# EAGLE schematic Schematic_rfclock_uwb (EAGLE 9.6.2)
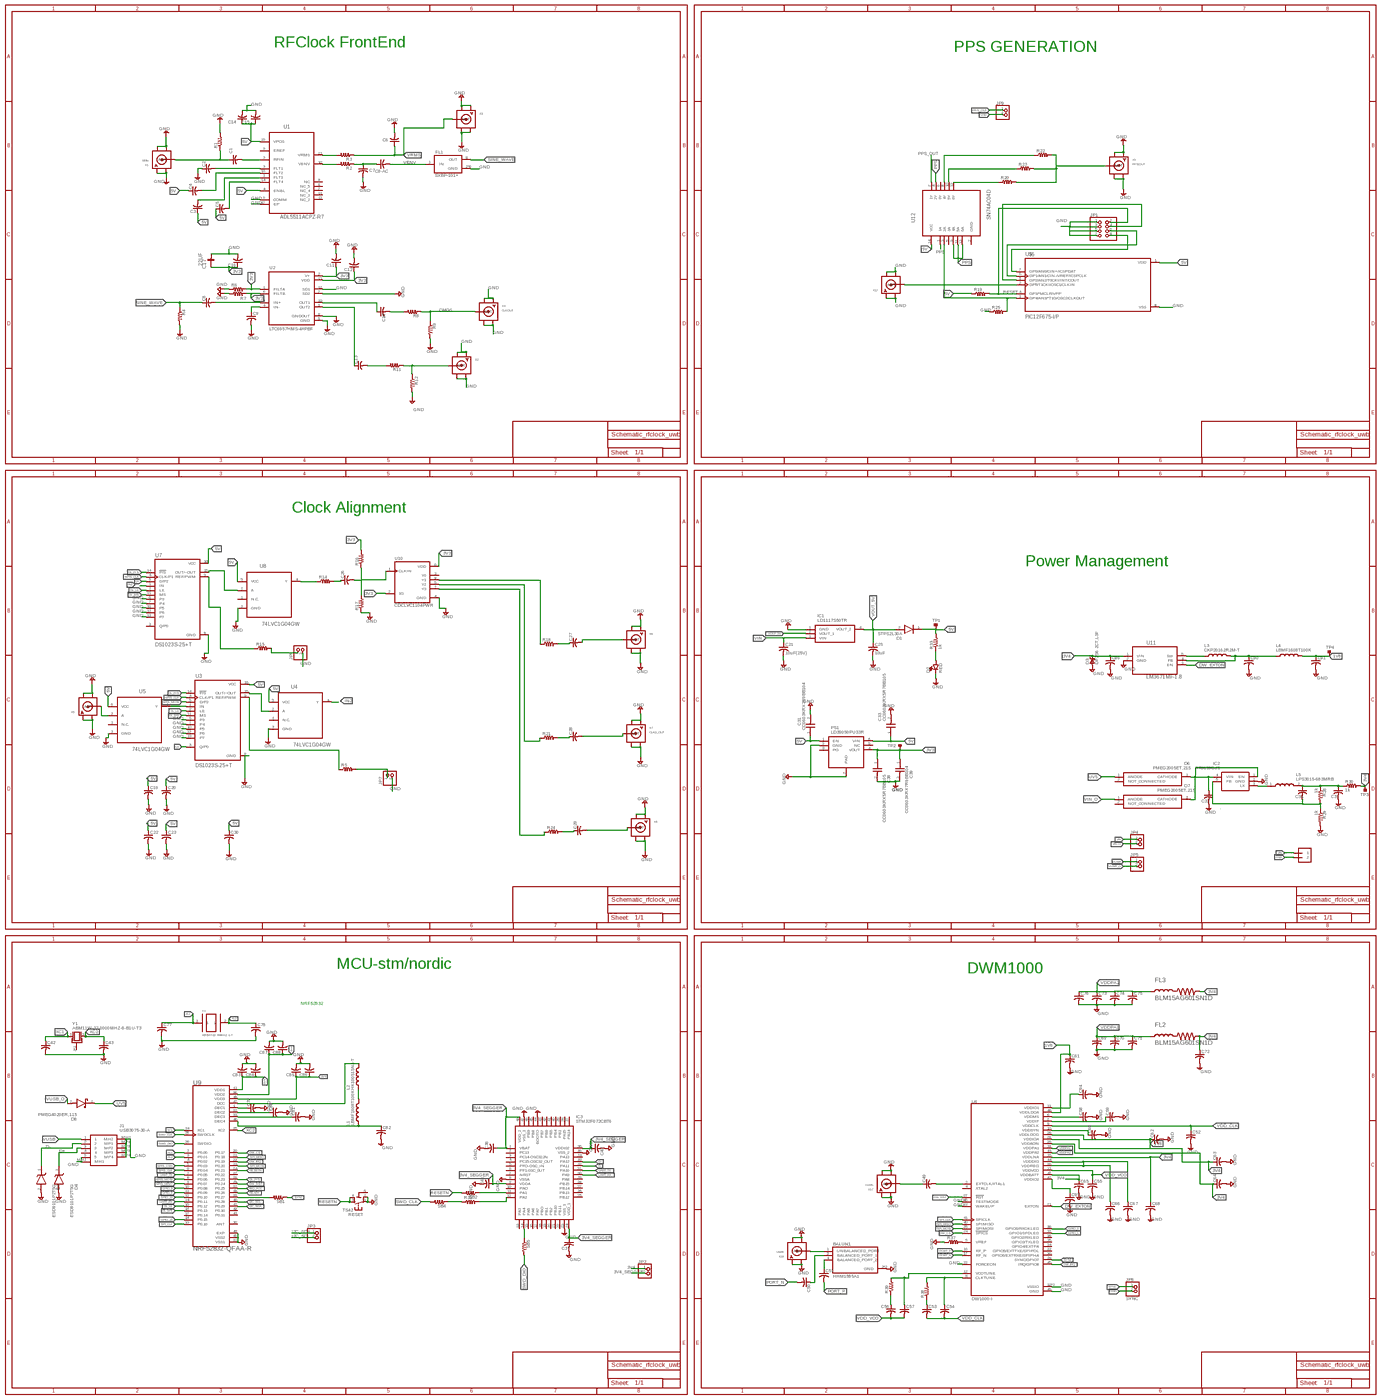
[diagram p0: schematic, sheet 1, overview]
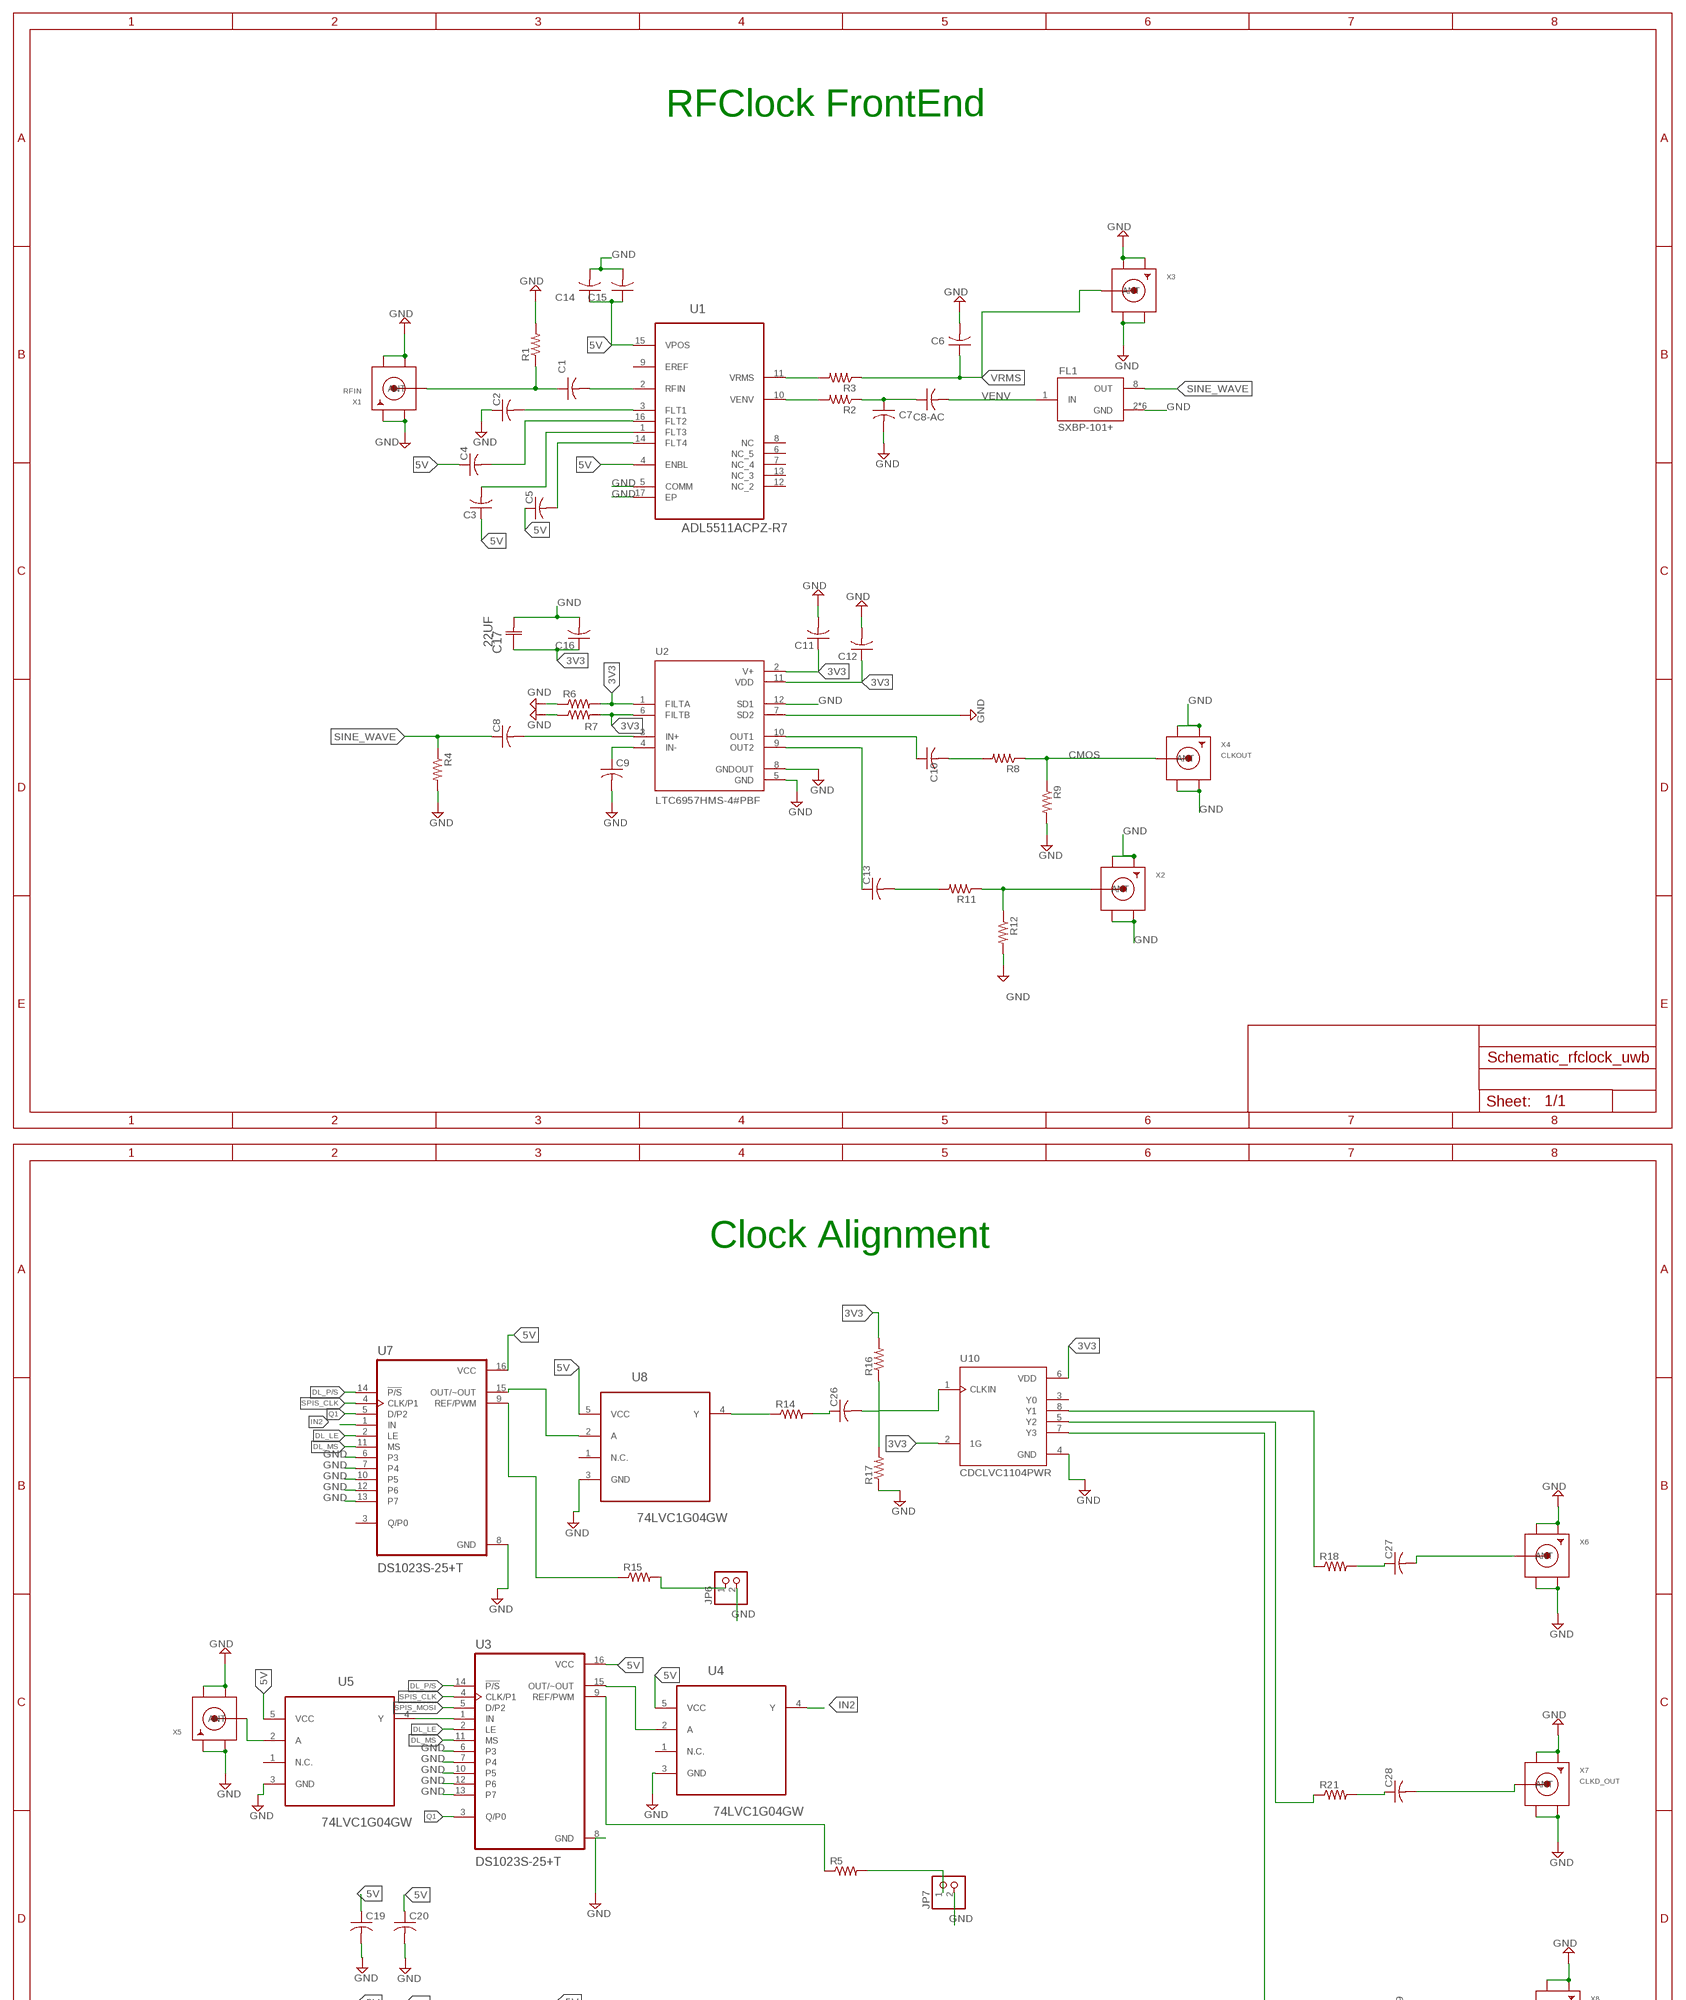
[diagram p1: schematic, sheet 1, part 1 of 4]
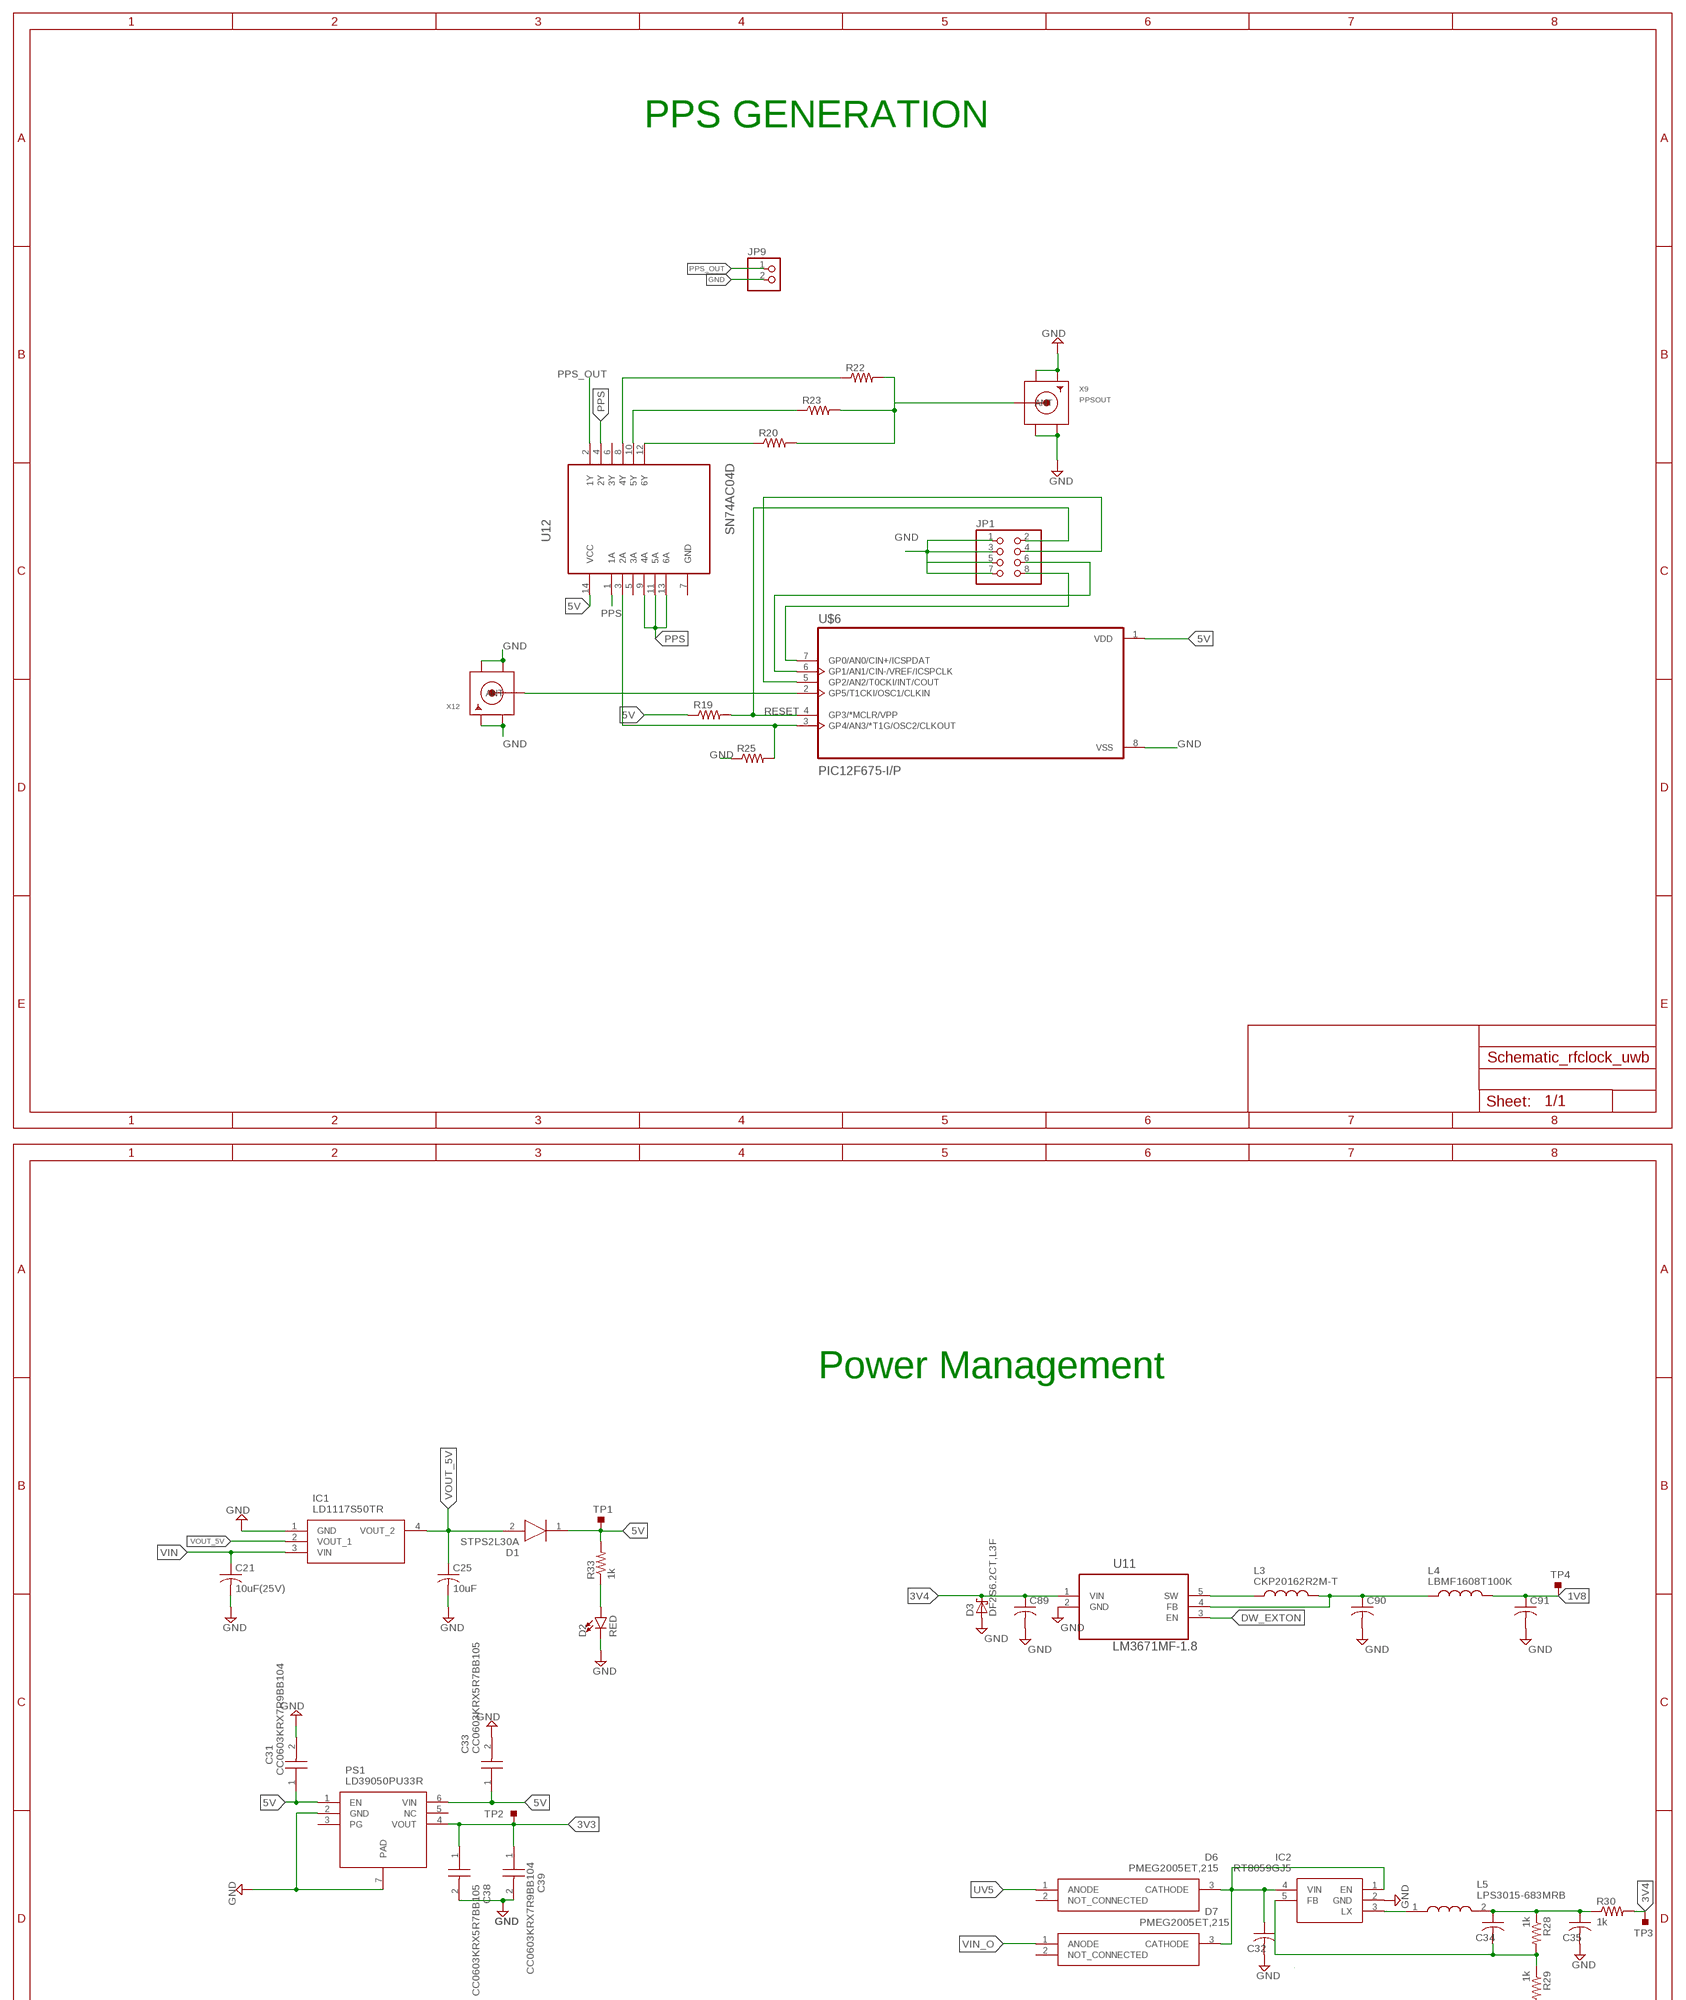
[diagram p2: schematic, sheet 1, part 2 of 4]
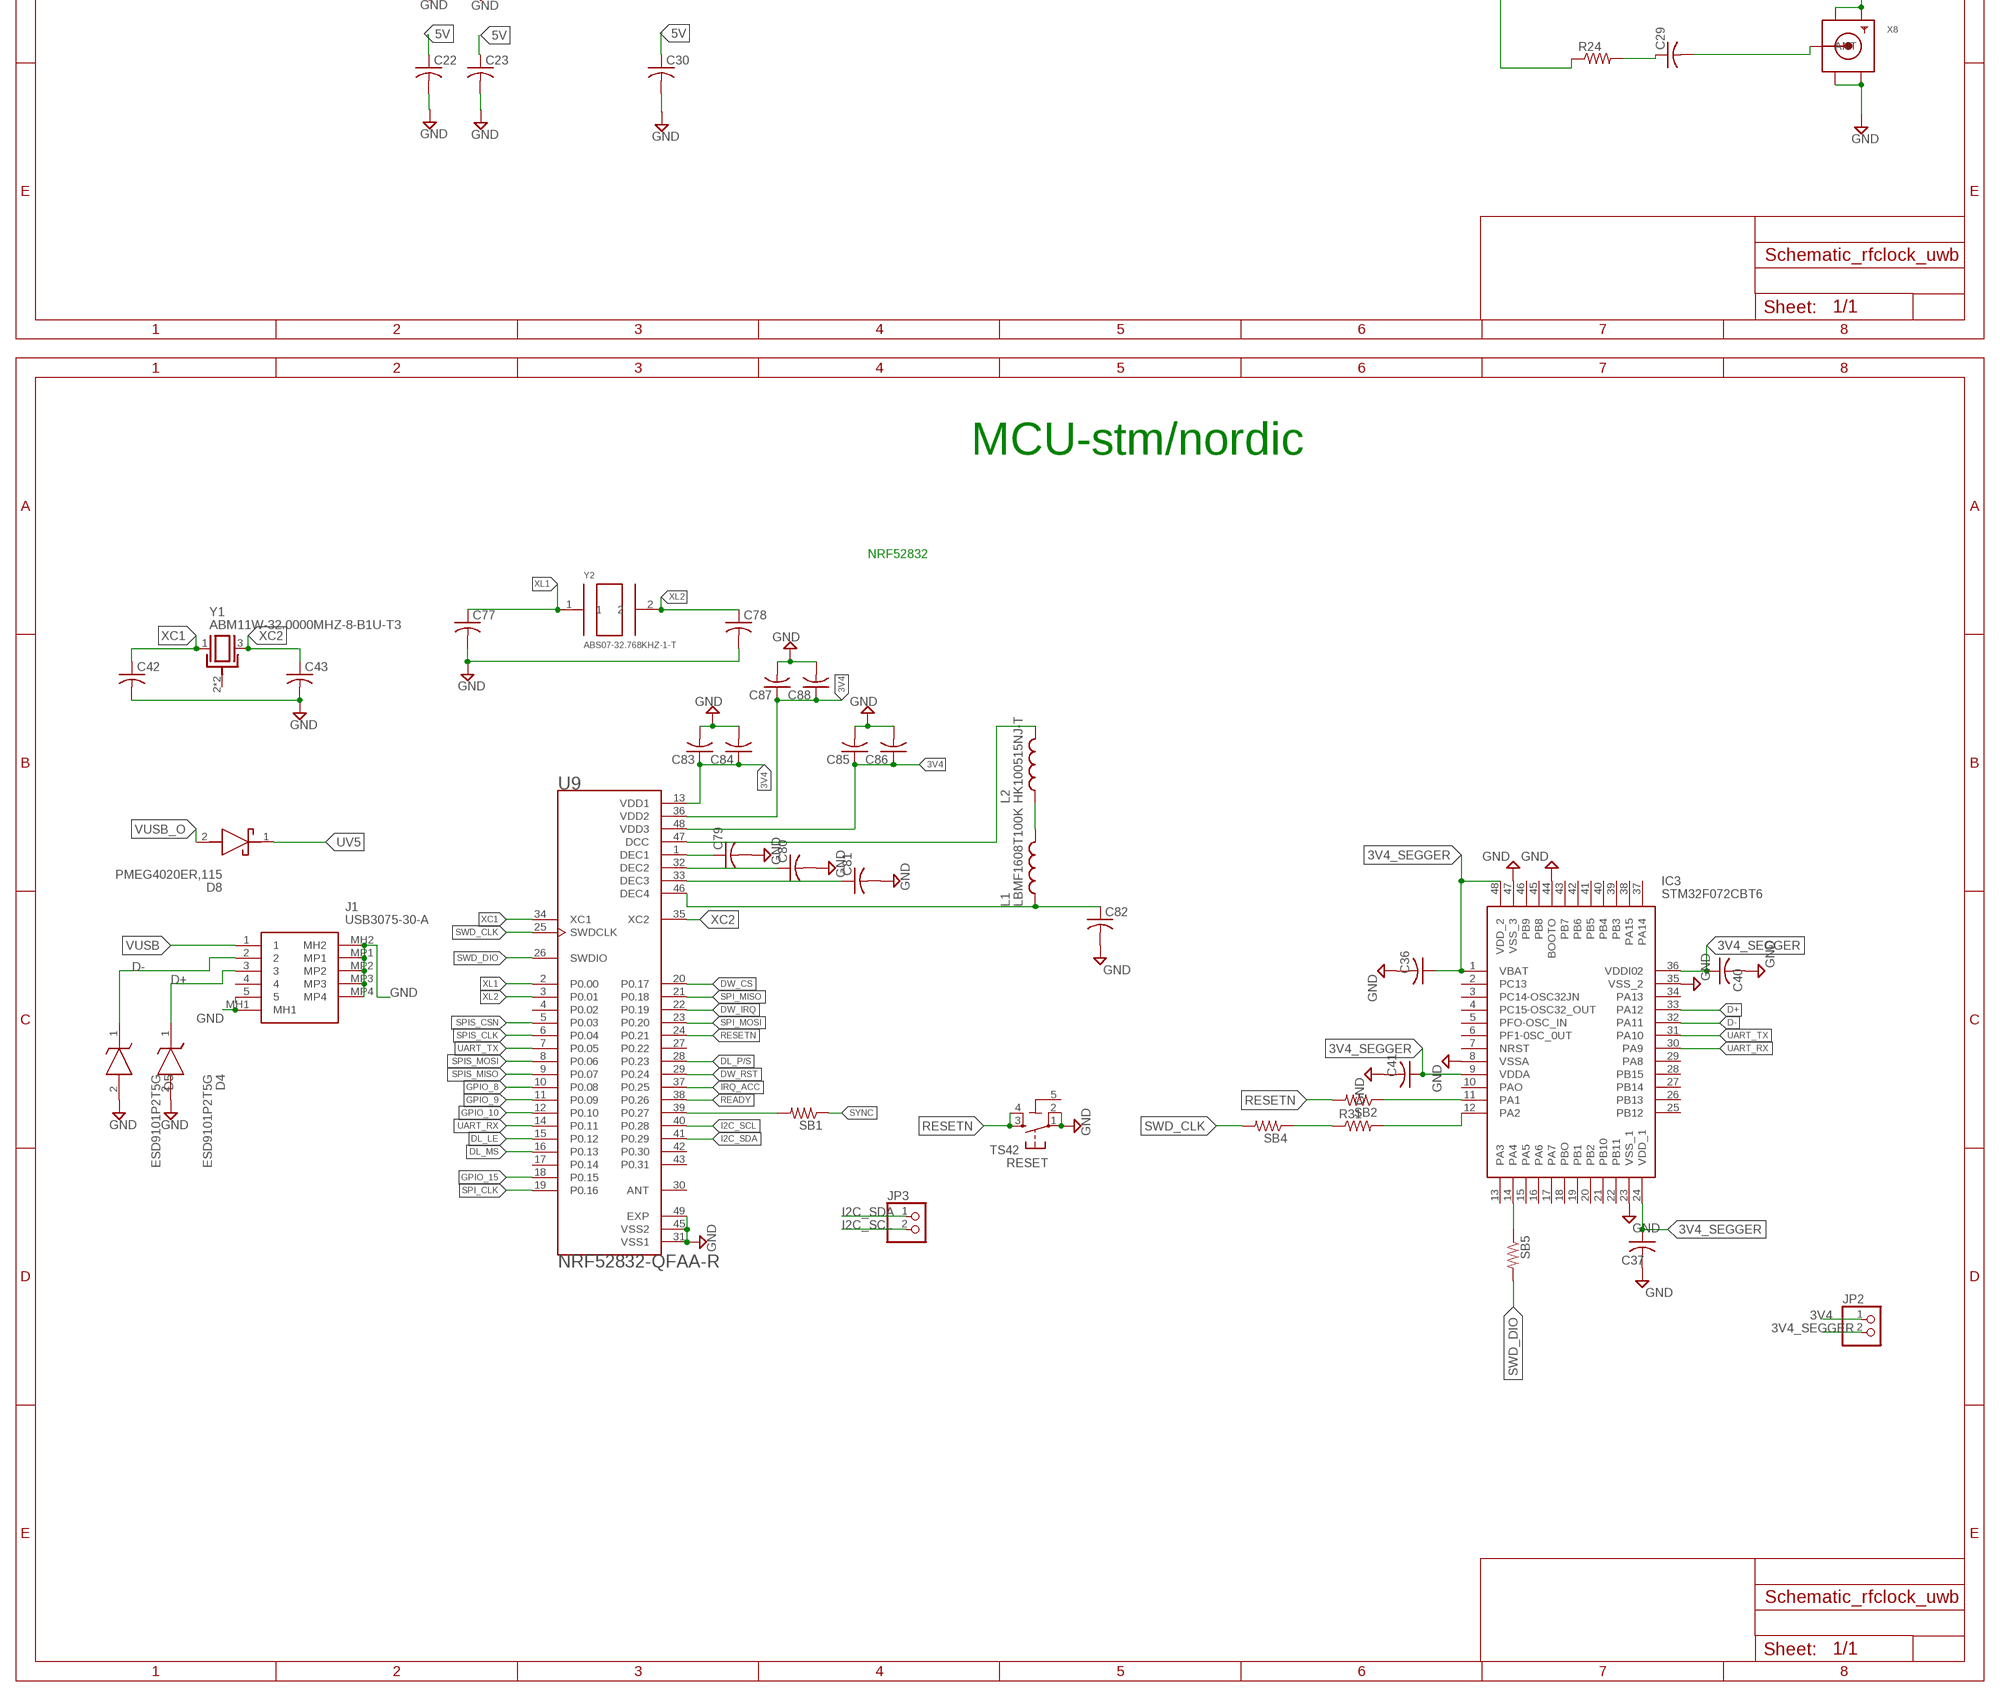
[diagram p3: schematic, sheet 1, part 3 of 4]
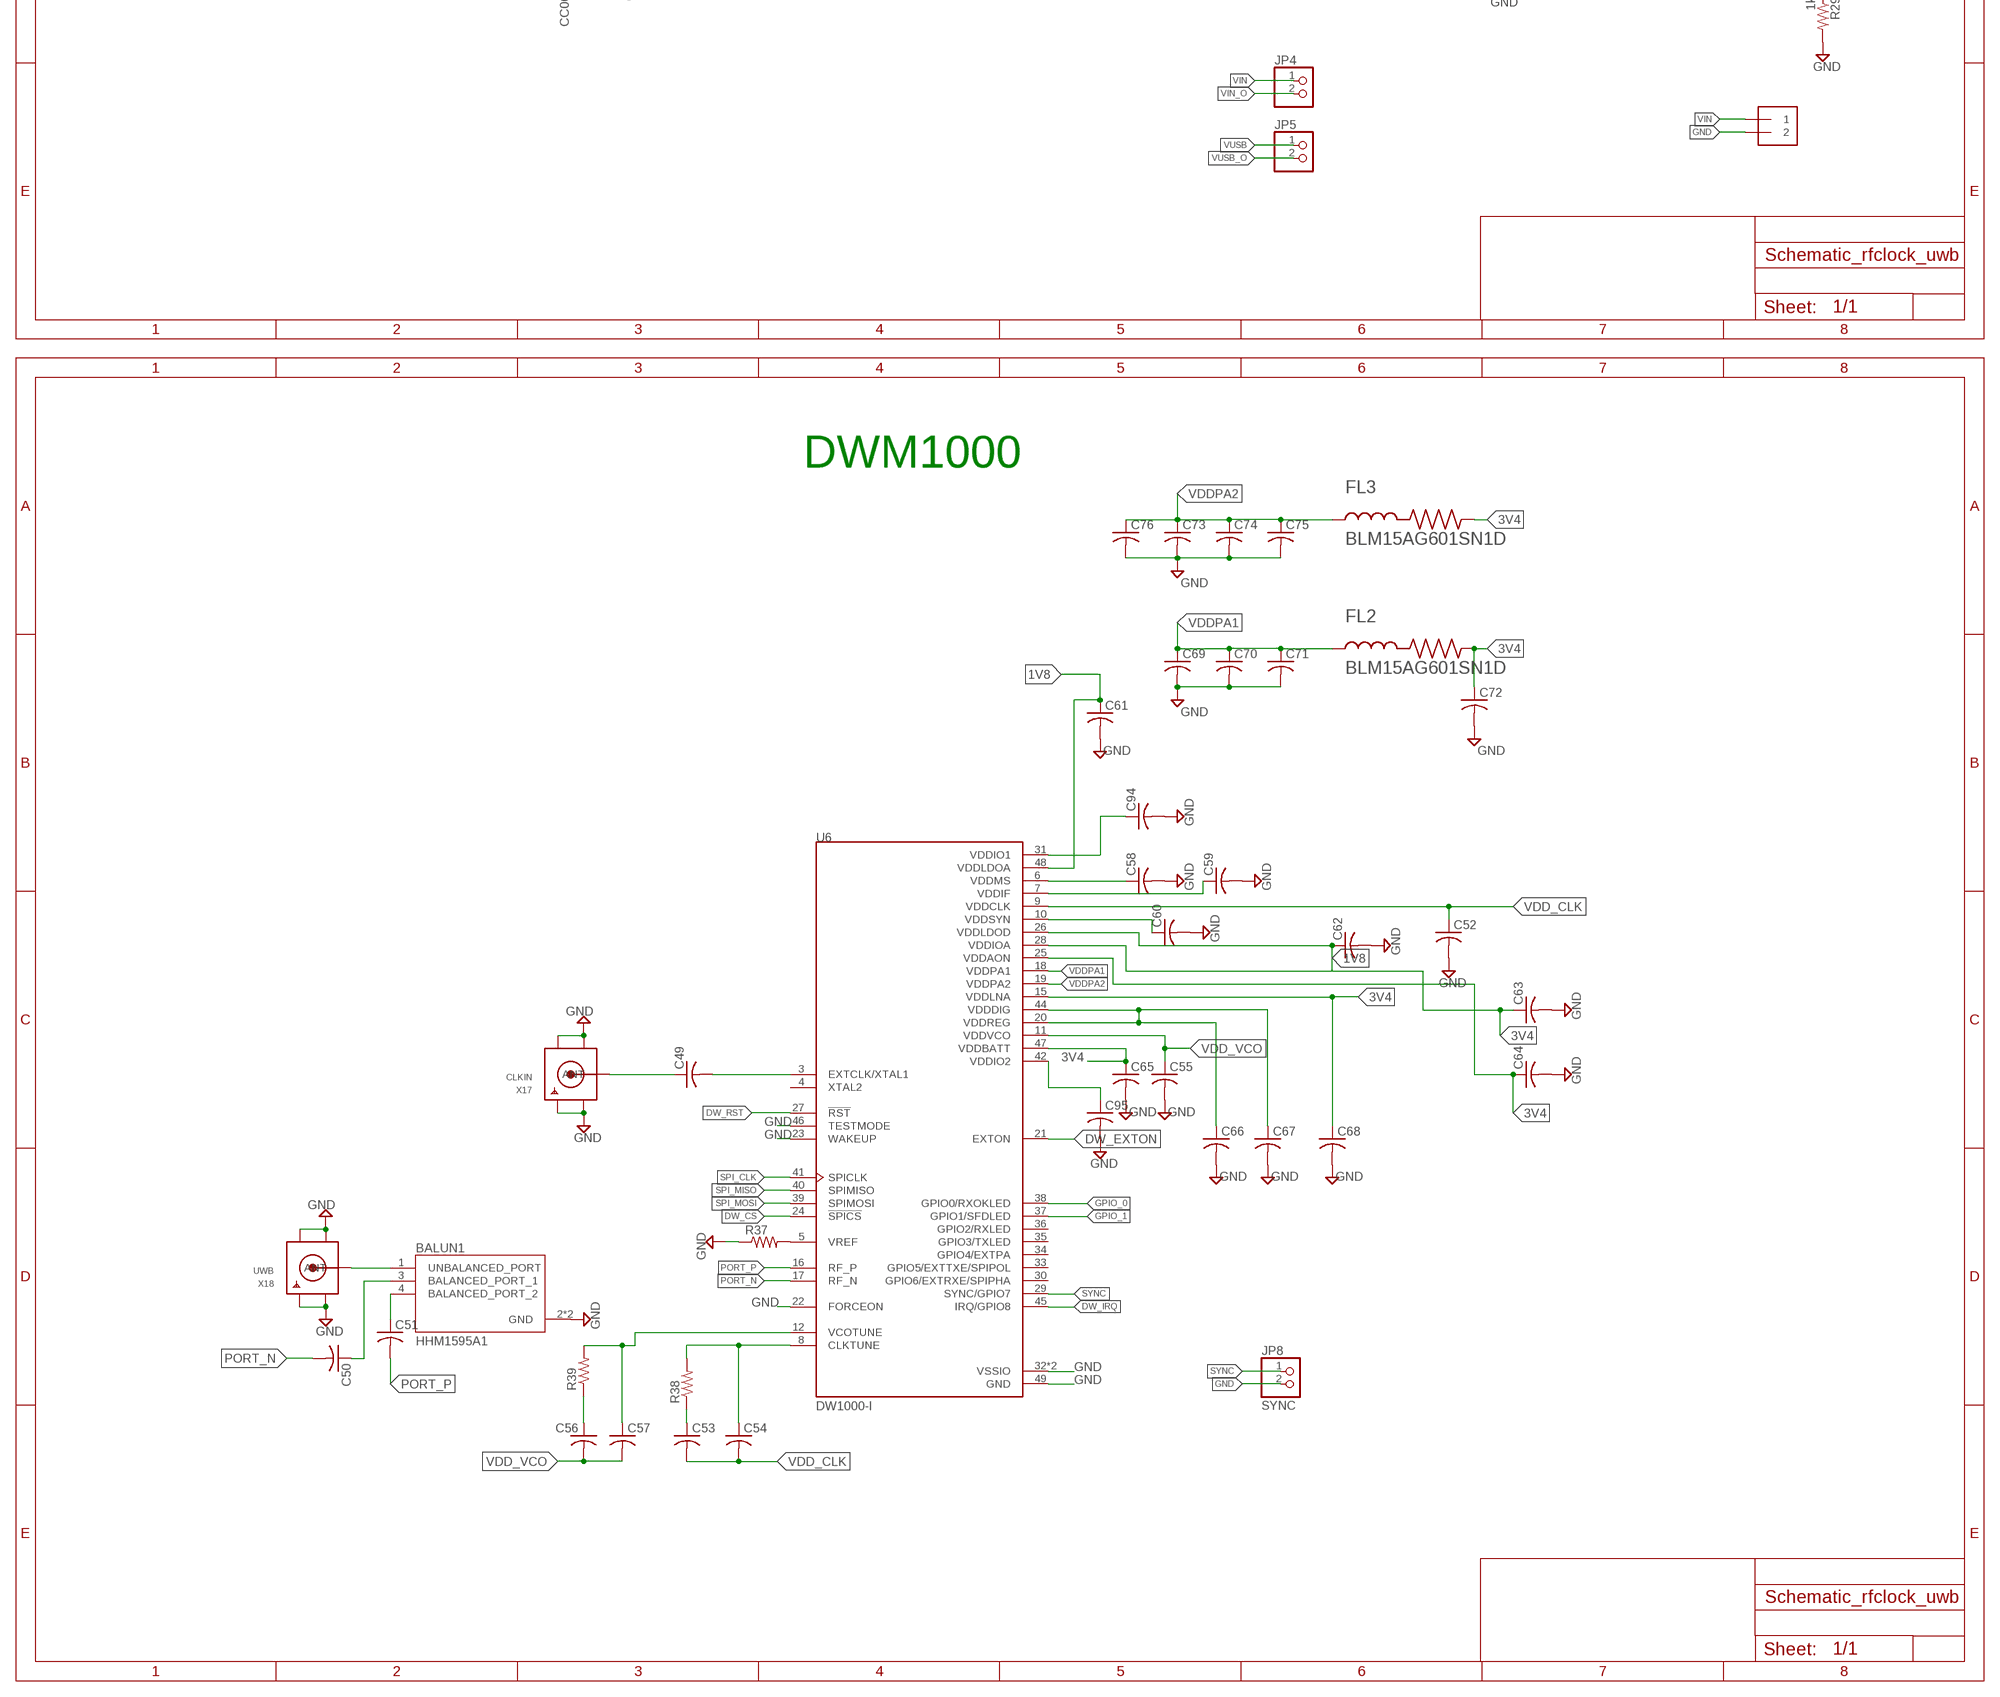
[diagram p4: schematic, sheet 1, part 4 of 4]

## Parts
BALUN1  HHM1595A1  [BALUN_HHM1595A1]
C1  C-USC0402K  [C0402K]
C2  C-USC0402K  [C0402K]
C3  C-USC0402  [C0402]
C4  C-USC0402  [C0402]
C5  C-USC0402  [C0402]
C6  C-USC0402  [C0402]
C7  C-USC0402  [C0402]
C8  C-USC0603  [C0603]
C8-AC  C-USC0402K  [C0402K]
C9  C-USC0603  [C0603]
C10  C-USC0603K  [C0603K]
C11  C-USC0603K  [C0603K]
C12  C-USC0603K  [C0603K]
C13  C-USC0603K  [C0603K]
C14  C-USC0402  [C0402]
C15  C-USC0402  [C0402]
C16  C-USC0603  [C0603]
C17  22UF  TPSB226M010R0700  [CAPCP3528X210N]
C19  C-USC0603K  [C0603K]
C20  C-USC0603K  [C0603K]
C21  10uF(25V)  C-USC1210  [C1210]
C22  C-USC0603K  [C0603K]
C23  C-USC0603  [C0603]
C25  10uF  C-USC1206  [C1206]
C26  1u  C-USC0603  [C0603]
C27  1u  C-USC0603  [C0603]
C28  1u  C-USC0603  [C0603]
C29  1u  C-USC0603  [C0603]
C30  C-USC0603K  [C0603K]
C31  CC0603KRX7R9BB104  [CAPC1608X90N]
C32  C-USC0603K  [C0603K]
C33  CC0603KRX5R7BB105  [CAPC1608X90N]
C34  C-USC0603K  [C0603K]
C35  C-USC0603K  [C0603K]
C36  C-USC0402K  [C0402K]
C37  C-USC0402K  [C0402K]
C38  CC0603KRX5R7BB105  [CAPC1608X90N]
C39  CC0603KRX7R9BB104  [CAPC1608X90N]
C40  C-USC0402K  [C0402K]
C41  C-USC0402K  [C0402K]
C42  C-USC0402K  [C0402K]
C43  C-USC0402K  [C0402K]
C49  C-USC0603K  [C0603K]
C50  C-USC0402K  [C0402K]
C51  C-USC0402K  [C0402K]
C52  C-USC0402K  [C0402K]
C53  C-USC0402K  [C0402K]
C54  C-USC0402K  [C0402K]
C55  C-USC0402K  [C0402K]
C56  C-USC0402K  [C0402K]
C57  C-USC0402K  [C0402K]
C58  C-USC0402K  [C0402K]
C59  C-USC0402K  [C0402K]
C60  C-USC0402K  [C0402K]
C61  C-USC0402K  [C0402K]
C62  C-USC0402K  [C0402K]
C63  C-USC0402K  [C0402K]
C64  C-USC0402K  [C0402K]
C65  C-USC0402K  [C0402K]
C66  C-USC0402K  [C0402K]
C67  C-USC0402K  [C0402K]
C68  C-USC0402K  [C0402K]
C69  C-USC0402K  [C0402K]
C70  C-USC0402K  [C0402K]
C71  C-USC0402K  [C0402K]
C72  C-USC0603K  [C0603K]
C73  C-USC0402K  [C0402K]
C74  C-USC0402K  [C0402K]
C75  C-USC0402K  [C0402K]
C76  C-USC0805K  [C0805K]
C77  C-USC0402K  [C0402K]
C78  C-USC0402K  [C0402K]
C79  C-USC0402K  [C0402K]
C80  C-USC0402K  [C0402K]
C81  C-USC0402K  [C0402K]
C82  C-USC0603K  [C0603K]
C83  C-USC0402K  [C0402K]
C84  C-USC0402K  [C0402K]
C85  C-USC0603K  [C0603K]
C86  C-USC0402K  [C0402K]
C87  C-USC0402K  [C0402K]
C88  C-USC0402K  [C0402K]
C89  C-USC0603K  [C0603K]
C90  C-USC0603K  [C0603K]
C91  C-USC0603K  [C0603K]
C94  C-USC0402K  [C0402K]
C95  C-USC0402K  [C0402K]
D1  STPS2L30A  [DIOM5126X265N]
D2  RED  LED-RED0603  [LED-0603]
D3  DF2S6.2CT,L3F  [DF2S6.2CT,L3F]
D4  ESD9101P2T5G  [SODFL1006X40N]
D5  ESD9101P2T5G  [SODFL1006X40N]
D6  PMEG2005ET,215  [SOT95P230X110-3N]
D7  PMEG2005ET,215  [SOT95P230X110-3N]
D8  PMEG4020ER,115  [SODFL3517X110N]
FL1  SXBP-101+  [FIL_SXBP-101+]
FL2  BLM15AG601SN1D  [BEADC1005X55N]
FL3  BLM15AG601SN1D  [BEADC1005X55N]
IC1  LD1117S50TR  [SOT230P700X190-4N]
IC2  RT8059GJ5  [SOT94P280X100-5N]
IC3  STM32F072CBT6  [QFP50P900X900X160-48N]
J1  USB3075-30-A  [USB307530A]
J2  1X2-3.5MM  [1X2-3.5MM]
JP1  PINHD-2X4  [2X04]
JP2  PINHD-1X2  [1X02]
JP3  PINHD-1X2  [1X02]
JP4  PINHD-1X2  [1X02]
JP5  PINHD-1X2  [1X02]
JP6  PINHD-1X2  [1X02]
JP7  PINHD-1X2  [1X02]
JP8  SYNC  PINHD-1X2  [1X02]
JP9  PINHD-1X2  [1X02]
L1  LBMF1608T100K  [INDC1608X100N]
L2  HK100515NJ-T  [INDC1005X55N]
L3  CKP20162R2M-T  [INDC2016X100N]
L4  LBMF1608T100K  [INDC1608X100N]
L5  LPS3015-683MRB  [LPS3015683MRB]
PS1  LD39050PU33R  [SON95P300X300X100-7N]
R1  R-US_R0402  [R0402]
R2  R-US_R0402  [R0402]
R3  R-US_R0402  [R0402]
R4  R-US_R0603  [R0603]
R5  R-US_R0805  [R0805]
R6  R-US_R0603  [R0603]
R7  R-US_R0603  [R0603]
R8  R-US_R0603  [R0603]
R9  R-US_R0603  [R0603]
R11  R-US_R0603  [R0603]
R12  R-US_R0603  [R0603]
R14  R-US_R0805  [R0805]
R15  R-US_R0805  [R0805]
R16  R-US_R0603  [R0603]
R17  R-US_R0603  [R0603]
R18  R-US_R0402  [R0402]
R19  R-US_R0603  [R0603]
R20  R-US_R0603  [R0603]
R21  R-US_R0402  [R0402]
R22  R-US_R0603  [R0603]
R23  R-US_R0603  [R0603]
R24  R-US_R0402  [R0402]
R25  R-US_R0603  [R0603]
R28  1k  R-US_R0603  [R0603]
R29  1k  R-US_R0603  [R0603]
R30  1k  R-US_R0603  [R0603]
R31  R-US_R0402  [R0402]
R33  1k  R-US_R0603  [R0603]
R37  R-US_R0402  [R0402]
R38  R-US_R0402  [R0402]
R39  R-US_R0402  [R0402]
RESET  TS42  [TS42]
SB1  R-US_R0402  [R0402]
SB2  R-US_R0402  [R0402]
SB4  R-US_R0402  [R0402]
SB5  R-US_R0402  [R0402]
TP1  TESTPOINT_TPS-PAD-036  [TESTPOINT_PAD-036]
TP2  TESTPOINT_TPS-PAD-036  [TESTPOINT_PAD-036]
TP3  TESTPOINT_TPS-PAD-036  [TESTPOINT_PAD-036]
TP4  TESTPOINT_TPS-PAD-036  [TESTPOINT_PAD-036]
U1  ADL5511ACPZ-R7  [QFN50P300X300X80-17N]
U2  LTC6957HMS-4#PBF  [SOP65P490X110-12N]
U3  DS1023S-25+T  [SOIC127P1032X265-16N]
U4  74LVC1G04GW  [SOT65P210X110-5N]
U5  74LVC1G04GW  [SOT65P210X110-5N]
U6  DW1000-I  [QFN40P600X600X90-49N]
U7  DS1023S-25+T  [SOIC127P1032X265-16N]
U8  74LVC1G04GW  [SOT65P210X110-5N]
U9  NRF52832-QFAA-R  [QFN40P600X600X90-49N]
U10  CDCLVC1104PWR  [SOP65P640X120-8N]
U11  LM3671MF-1.8  [SOT95P284X122-5N]
U12  SN74AC04D  [SOIC127P600X175-14N]
U$6  PIC12F675-I/P  [DIP787W46P254L927H533Q8]
X1  RFIN  SMACONNECTOR_EDGE  [SMA_EDGELAUNCH]
X2  SMACONNECTOR  [SMA90_DIP]
X3  SMACONNECTOR_EDGE  [SMA_EDGELAUNCH]
X4  CLKOUT  SMACONNECTOR  [SMA90_DIP]
X5  SMACONNECTOR_EDGE  [SMA_EDGELAUNCH]
X6  SMACONNECTOR_EDGE  [SMA_EDGELAUNCH]
X7  CLKD_OUT  SMACONNECTOR_EDGE  [SMA_EDGELAUNCH]
X8  SMACONNECTOR_EDGE  [SMA_EDGELAUNCH]
X9  PPSOUT  SMACONNECTOR_EDGE  [SMA_EDGELAUNCH]
X12  SMACONNECTOR_EDGE  [SMA_EDGELAUNCH]
X17  CLKIN  SMACONNECTOR_EDGE  [SMA_EDGELAUNCH]
X18  UWB  SMACONNECTOR_EDGE  [SMA_EDGELAUNCH]
Y1  ABM11W-32.0000MHZ-8-B1U-T3  [XTAL_ABM11W-32.0000MHZ-8-B1U-T3]
Y2  ABS07-32.768KHZ-1-T  [XTAL320X150X90]

## Nets
1V8: C61.1 C62.1 C91.1 L4.2 TP4.1(TP) U6.26(VDDLDOD) U6.48(VDDLDOA)
3V3: C11.1 C12.1 C16.1 C17.1(C1) C38.1 C39.1 PS1.4(VOUT) R6.2 R7.2 R16.2 TP2.1(TP) U2.1(FILTA) U2.2(V+) U2.6(FILTB) U2.11(VDD) U10.2(1G) U10.6(VDD)
3V4: C63.1 C64.1 C65.1 C68.1 C72.1 C83.1 C84.1 C85.1 C86.1 C87.1 C88.1 C89.1 D3.2 FL2.2 FL3.2 JP2.1 R30.2 TP3.1(TP) U6.15(VDDLNA) U6.25(VDDAON) U6.28(VDDIOA) U6.47(VDDBATT) U9.13(VDD1) U9.36(VDD2) U9.48(VDD3) U11.1(VIN)
3V4_SEGGER: C36.1 C37.1 C40.1 C41.1 IC3.1(VBAT) IC3.9(VDDA) IC3.24(VDD_1) IC3.36(VDDI02) IC3.48(VDD_2) JP2.2
5V: C3.1 C4.1 C5.1 C14.1 C15.1 C19.1 C20.1 C22.1 C23.1 C30.1 C31.1 C33.1 D1.1(K) PS1.1(EN) PS1.6(VIN) R19.1 R33.2 TP1.1(TP) U1.4(ENBL) U1.15(VPOS) U3.16(VCC) U4.5(VCC) U5.5(VCC) U7.16(VCC) U8.5(VCC) U12.14(VCC) U$6.1(VDD)
CMOS: R8.1 R9.1 X4.ANTENNA(ANT)
D+: D4.1(K) IC3.33(PA12) J1.3
D-: D5.1(K) IC3.32(PA11) J1.2
DL_LE: U3.2(LE) U7.2(LE) U9.15(P0.12)
DL_MS: U3.11(MS) U7.11(MS) U9.16(P0.13)
DL_P/S: U3.14(!P/S) U7.14(!P/S) U9.28(P0.23)
DW_CS: U6.24(!SPICS) U9.20(P0.17)
DW_EXTON: U6.21(EXTON) U11.3(EN)
DW_IRQ: U6.45(IRQ/GPIO8) U9.22(P0.19)
DW_RST: U6.27(!RST) U9.29(P0.24)
GND: BALUN1.2(GND) BALUN1.5(GND) C2.1 C6.2 C7.2 C9.2 C11.2 C12.2 C14.2 C15.2 C16.2 C17.2(C2) C19.2 C20.2 C21.2 C22.2 C23.2 C25.2 C30.2 C31.2 C32.2 C33.2 C35.2 C36.2 C37.2 C38.2 C39.2 C40.2 C41.2 C42.2 C43.2 C52.2 C55.2 C58.2 C59.2 C60.2 C61.2 C62.2 C63.2 C64.2 C65.2 C66.2 C67.2 C68.2 C69.2 C70.2 C71.2 C72.2 C73.2 C74.2 C75.2 C76.2 C77.2 C78.2 C79.2 C80.2 C81.2 C82.2 C83.2 C84.2 C85.2 C86.2 C87.2 C88.2 C89.2 C90.2 C91.2 C94.2 C95.2 D2.C D3.1 D4.2(A) D5.2(A) FL1.2(GND) FL1.3(GND) FL1.4(GND) FL1.5(GND) FL1.6(GND) FL1.7(GND) IC1.1(GND) IC2.2(GND) IC3.8(VSSA) IC3.23(VSS_1) IC3.35(VSS_2) IC3.44(BOOTO) IC3.47(VSS_3) J1.MH1 J1.MH2 J1.MP1 J1.MP2 J1.MP3 J1.MP4 J2.2 JP1.1 JP1.3 JP1.5 JP1.7 JP6.2 JP7.2 JP8.2 JP9.2 PS1.2(GND) PS1.7(PAD) R1.2 R4.2 R6.1 R7.1 R9.2 R12.2 R17.1 R25.1 R29.2 R37.1 RESET.1 RESET.2 U1.5(COMM) U1.17(EP) U2.5(GND) U2.7(SD2) U2.8(GNDOUT) U2.12(SD1) U3.6(P3) U3.7(P4) U3.8(GND) U3.10(P5) U3.12(P6) U3.13(P7) U4.3(GND) U5.3(GND) U6.22(FORCEON) U6.23(WAKEUP) U6.32(VSSIO) U6.43(VSSIO) U6.46(TESTMODE) U6.49(GND) U7.6(P3) U7.7(P4) U7.8(GND) U7.10(P5) U7.12(P6) U7.13(P7) U8.3(GND) U9.31(VSS1) U9.45(VSS2) U9.49(EXP) U10.4(GND) U11.2(GND) U$6.8(VSS) X1.GND@1(GND4) X1.GND@2(GND3) X1.GND@3(GND2) X1.GND@4(GND1) X2.GND1 X2.GND2 X2.GND3 X2.GND4 X3.GND@1(GND4) X3.GND@2(GND3) X3.GND@3(GND2) X3.GND@4(GND1) X4.GND1 X4.GND2 X4.GND3 X4.GND4 X5.GND@1(GND4) X5.GND@2(GND3) X5.GND@3(GND2) X5.GND@4(GND1) X6.GND@1(GND4) X6.GND@2(GND3) X6.GND@3(GND2) X6.GND@4(GND1) X7.GND@1(GND4) X7.GND@2(GND3) X7.GND@3(GND2) X7.GND@4(GND1) X8.GND@1(GND4) X8.GND@2(GND3) X8.GND@3(GND2) X8.GND@4(GND1) X9.GND@1(GND4) X9.GND@2(GND3) X9.GND@3(GND2) X9.GND@4(GND1) X12.GND@1(GND4) X12.GND@2(GND3) X12.GND@3(GND2) X12.GND@4(GND1) X17.GND@1(GND4) X17.GND@2(GND3) X17.GND@3(GND2) X17.GND@4(GND1) X18.GND@1(GND4) X18.GND@2(GND3) X18.GND@3(GND2) X18.GND@4(GND1)
GPIO_0: U6.38(GPIO0/RXOKLED)
GPIO_1: U6.37(GPIO1/SFDLED)
GPIO_8: U9.10(P0.08)
GPIO_9: U9.11(P0.09)
GPIO_10: U9.12(P0.10)
GPIO_15: U9.18(P0.15)
I2C_SCL: JP3.2 U9.40(P0.28)
I2C_SDA: JP3.1 U9.41(P0.29)
IN2: U4.4(Y) U7.1(IN)
IRQ_ACC: U9.37(P0.25)
N$1: C1.2 U1.2(RFIN)
N$2: C2.2 U1.3(FLT1)
N$3: C1.1 R1.1 X1.P(ANT)
N$4: C3.2 U1.1(FLT3)
N$5: C5.2 U1.14(FLT4)
N$6: C4.2 U1.16(FLT2)
N$7: R3.2 U1.11(VRMS)
N$8: R2.2 U1.10(VENV)
N$9: C7.1 C8-AC.1 R2.1
N$10: C9.1 U2.4(IN-)
N$11: C8.2 U2.3(IN+)
N$12: C10.1 U2.10(OUT1)
N$13: C10.2 R8.2
N$14: C13.1 U2.9(OUT2)
N$15: C13.2 R11.2
N$16: R11.1 R12.1 X2.ANTENNA(ANT)
N$17: U3.15(OUT/~OUT) U4.2(A)
N$18: U3.1(IN) U5.4(Y)
N$19: U5.2(A) X5.P(ANT)
N$20: U7.15(OUT/~OUT) U8.2(A)
N$21: R14.1 U8.4(Y)
N$22: R15.1 U7.9(REF/PWM)
N$23: C32.1 D6.3(CATHODE) D7.3(CATHODE) IC2.1(EN) IC2.4(VIN)
N$24: C26.1 R14.2
N$25: C26.2 R16.1 R17.2 U10.1(CLKIN)
N$26: C27.1 R18.2
N$27: R25.2 U12.3(2A) U$6.3(GP4/AN3/*T1G/OSC2/CLKOUT)
N$28: C28.1 R21.2
N$29: C28.2 X7.P(ANT)
N$30: C29.1 R24.2
N$31: C29.2 X8.P(ANT)
N$32: R18.1 U10.8(Y1)
N$33: R21.1 U10.5(Y2)
N$34: R24.1 U10.7(Y3)
N$35: JP6.1 R15.2
N$36: JP7.1 R5.2
N$37: R5.1 U3.9(REF/PWM)
N$38: C27.2 X6.P(ANT)
N$39: D2.A R33.1
N$40: R20.1 U12.12(6Y)
N$41: R23.1 U12.10(5Y)
N$42: R22.1 U12.8(4Y)
N$44: J1.5
N$45: JP1.6 U$6.6(GP1/AN1/CIN-/VREF/ICSPCLK)
N$46: R20.2 R22.2 R23.2 X9.P(ANT)
N$47: JP1.4 U$6.5(GP2/AN2/T0CKI/INT/COUT)
N$48: JP1.8 U$6.7(GP0/AN0/CIN+/ICSPDAT)
N$50: U$6.2(GP5/T1CKI/OSC1/CLKIN) X12.P(ANT)
N$51: C49.1 X17.P(ANT)
N$52: IC2.3(LX) L5.1
N$53: C49.2 U6.3(EXTCLK/XTAL1)
N$54: C34.1 C35.1 L5.2 R28.1 R30.1
N$55: R37.2 U6.5(VREF)
N$56: BALUN1.1(UNBALANCED_PORT) X18.P(ANT)
N$57: BALUN1.4(BALANCED_PORT_2) C51.1
N$58: C53.1 R38.1
N$59: C57.1 R39.2 U6.12(VCOTUNE)
N$60: C56.1 R39.1
N$61: C94.1 U6.31(VDDIO1)
N$62: C58.1 U6.6(VDDMS)
N$63: C59.1 U6.7(VDDIF)
N$64: C60.1 U6.10(VDDSYN)
N$65: C66.1 C67.1 U6.20(VDDREG) U6.44(VDDDIG)
N$66: C79.1 U9.1(DEC1)
N$67: C80.1 U9.32(DEC2)
N$68: C81.1 U9.33(DEC3)
N$69: C82.1 L1.1 U9.46(DEC4)
N$70: L1.2 L2.1
N$71: L2.2 U9.47(DCC)
N$72: L3.1 U11.5(SW)
N$73: C90.1 L3.2 L4.1 U11.4(FB)
N$74: C54.1 R38.2 U6.8(CLKTUNE)
N$75: C95.1 U6.42(VDDIO2)
N$76: BALUN1.3(BALANCED_PORT_1) C50.1
N$77: C34.2 IC2.5(FB) R28.2 R29.1
N$78: SB1.2 U9.39(P0.27)
N$79: IC3.11(PA1) SB2.1
N$80: IC3.12(PA2) R31.2
N$81: R31.1 SB4.1
N$82: IC3.14(PA4) SB5.1
PORT_N [diff_pairs]: C50.2 U6.17(RF_N)
PORT_P [diff_pairs]: C51.2 U6.16(RF_P)
PPS: U12.1(1A) U12.4(2Y) U12.9(4A) U12.11(5A) U12.13(6A)
PPS_OUT: JP9.1 U12.2(1Y)
Q1: U3.3(Q/P0) U7.5(D/P2)
READY: U9.38(P0.26)
RESET: JP1.2 R19.2 U$6.4(GP3/*MCLR/VPP)
RESETN: RESET.3 RESET.4 SB2.2 U9.24(P0.21)
SINE_WAVE: C8.1 FL1.8(OUT) R4.1
SPI_CLK: U6.41(SPICLK) U9.19(P0.16)
SPI_MISO: U6.40(SPIMISO) U9.21(P0.18)
SPI_MOSI: U6.39(SPIMOSI) U9.23(P0.20)
SPIS_CLK: U3.4(CLK/P1) U7.4(CLK/P1) U9.6(P0.04)
SPIS_CSN: U9.5(P0.03)
SPIS_MISO: U9.9(P0.07)
SPIS_MOSI: U3.5(D/P2) U9.8(P0.06)
SWD_CLK: SB4.2 U9.25(SWDCLK)
SWD_DIO: SB5.2 U9.26(SWDIO)
SYNC: JP8.1 SB1.1 U6.29(SYNC/GPIO7)
UART_RX: IC3.30(PA9) U9.14(P0.11)
UART_TX: IC3.31(PA10) U9.7(P0.05)
UV5: D6.1(ANODE) D8.1(K)
VDD_CLK: C52.1 C53.2 C54.2 U6.9(VDDCLK)
VDD_VCO: C55.1 C56.2 C57.2 U6.11(VDDVCO)
VDDPA1: C69.1 C70.1 C71.1 FL2.1 U6.18(VDDPA1)
VDDPA2: C73.1 C74.1 C75.1 C76.1 FL3.1 U6.19(VDDPA2)
VENV: C8-AC.2 FL1.1(IN)
VIN: C21.1 IC1.3(VIN) J2.1 JP4.1
VIN_O: D7.1(ANODE) JP4.2
VOUT_5V: C25.1 D1.2(A) IC1.2(VOUT_1) IC1.4(VOUT_2)
VRMS: C6.1 R3.1 X3.P(ANT)
VUSB: J1.1 JP5.1
VUSB_O: D8.2(A) JP5.2
XC1: C42.1 U9.34(XC1) Y1.1
XC2: C43.1 U9.35(XC2) Y1.3
XL1: C77.1 U9.2(P0.00) Y2.1
XL2: C78.1 U9.3(P0.01) Y2.2
Unconnected: D6.2(NOT_CONNECTED) D7.2(NOT_CONNECTED) IC3.2(PC13) IC3.3(PC14-OSC32JN) IC3.4(PC15-OSC32_OUT) IC3.5(PFO-OSC_IN) IC3.6(PF1-0SC_0UT) IC3.7(NRST) IC3.10(PAO) IC3.13(PA3) IC3.15(PA5) IC3.16(PA6) IC3.17(PA7) IC3.18(PBO) IC3.19(PB1) IC3.20(PB2) IC3.21(PB10) IC3.22(PB11) IC3.25(PB12) IC3.26(PB13) IC3.27(PB14) IC3.28(PB15) IC3.29(PA8) IC3.34(PA13) IC3.37(PA14) IC3.38(PA15) IC3.39(PB3) IC3.40(PB4) IC3.41(PB5) IC3.42(PB6) IC3.43(PB7) IC3.45(PB8) IC3.46(PB9) J1.4 PS1.3(PG) PS1.5(NC) U1.6(NC_5) U1.7(NC_4) U1.8(NC) U1.9(EREF) U1.12(NC_2) U1.13(NC_3) U4.1(N.C.) U5.1(N.C.) U6.4(XTAL2) U6.30(GPIO6/EXTRXE/SPIPHA) U6.33(GPIO5/EXTTXE/SPIPOL) U6.34(GPIO4/EXTPA) U6.35(GPIO3/TXLED) U6.36(GPIO2/RXLED) U7.3(Q/P0) U8.1(N.C.) U9.4(P0.02) U9.17(P0.14) U9.27(P0.22) U9.30(ANT) U9.42(P0.30) U9.43(P0.31) U10.3(Y0) U12.5(3A) U12.6(3Y) U12.7(GND)

## Notes on the sheet
- RFClock FrontEnd | PPS GENERATION
- Clock Alignment
- Power Management
- MCU-stm/nordic | DWM1000
- NRF52832

## Power pins joined to a net without a drawn wire
5-GND: RESET.5(5-GND)
GND: Y1.2(GND) Y1.4(GND)

## Library data of the parts
BALUN1 = HHM1595A1:HHM1595A1: Baluns 50/100ohm, 3-8GHz Ultrawideband Balun; AVAILABILITY: Unavailable; DESCRIPTION: RF Balun 3GHz ~ 8GHz 50 / 100Ohm 0805 _2012 Metric_; DIGIKEY-PURCHASE-URL: https://snapeda.com/shop?store=DigiKey&id=490384; MF: TDK; MP: HHM1595A1; PACKAGE: 0805 TDK; PRICE: None
C1-C8 C8-AC C9-C16 C19-C23 C25-C30 C36 C37 C40 C41 C76 = rcl:C-US: CAPACITOR, American symbol; SPICEPREFIX: C
C17 = AVX_By_element14_Batch_1:TPSB226M010R0700: Tantalum Capacitor , 1210; CAPACITANCETOLERANCE: ±20%; MPN: TPSB226M010R0700; OC_FARNELL: 9862439; OC_NEWARK: 36K3657; SUPPLIER: AVX; VOLTAGERATING: 10V
C31 C39 = CC0603KRX7R9BB104:CC0603KRX7R9BB104: CAPACITOR, 0603 100nF +/-10% 50V Source: Datasheet <http://componentsearchengine.com/Datasheets/3/CC0603KRX7R9BB104.pdf>; ARROW_PART_NUMBER: CC0603KRX7R9BB104; ARROW_PRICE-STOCK: https://www.arrow.com/en/products/cc0603krx7r9bb104/yageo; DESCRIPTION: CAPACITOR, 0603 100nF +/-10% 50V; HEIGHT: 0.9mm; MANUFACTURER_NAME: YAGEO (PHYCOMP); MANUFACTURER_PART_NUMBER: CC0603KRX7R9BB104; MOUSER_PART_NUMBER: 603-CC603KRX7R9BB104; MOUSER_PRICE-STOCK: https://www.mouser.co.uk/ProductDetail/Yageo/CC0603KRX7R9BB104?qs=vTakOoo5QyLvVCYM2ge8LQ%3D%3D
C32 C34 C35 C42 C43 C49-C75 C77-C91 C94 C95 = adafruit:C-US: CAPACITOR, American symbol
C33 C38 = CC0603KRX5R7BB105:CC0603KRX5R7BB105: YAGEO - CC0603KRX5R7BB105 - CERAMIC CAPACITOR, 1UF, 16V, X5R, 10%, 0603, FULL REEL Source: Datasheet <https://componentsearchengine.com/Datasheets/2/CC0603KRX5R7BB105.pdf>; ARROW_PART_NUMBER: CC0603KRX5R7BB105; ARROW_PRICE-STOCK: https://www.arrow.com/en/products/cc0603krx5r7bb105/yageo; DESCRIPTION: YAGEO - CC0603KRX5R7BB105 - CERAMIC CAPACITOR, 1UF, 16V, X5R, 10%, 0603, FULL REEL; HEIGHT: 0.9mm; MANUFACTURER_NAME: YAGEO (PHYCOMP); MANUFACTURER_PART_NUMBER: CC0603KRX5R7BB105; MOUSER_PART_NUMBER: 603-CC603KRX5R7BB105; MOUSER_PRICE-STOCK: https://www.mouser.com/Search/Refine.aspx?Keyword=603-CC603KRX5R7BB105
D1 = STPS2L30A:STPS2L30A: STPS2L30A, Schottky Diode, 2A max, 30V, 2-Pin, SMA Source: Datasheet <http://www.st.com/web/en/resource/technical/document/datasheet/CD00001633.pdf>; ARROW_PART_NUMBER: STPS2L30A; ARROW_PRICE-STOCK: https://www.arrow.com/en/products/stps2l30a/stmicroelectronics; DESCRIPTION: STPS2L30A, Schottky Diode, 2A max, 30V, 2-Pin, SMA; HEIGHT: 2.65mm; MANUFACTURER_NAME: STMicroelectronics; MANUFACTURER_PART_NUMBER: STPS2L30A; MOUSER_PART_NUMBER: 511-STPS2L30A; MOUSER_PRICE-STOCK: https://www.mouser.com/Search/Refine.aspx?Keyword=511-STPS2L30A
D2 = SparkFun-LED:LED-RED: Red SMD LED Used in manufacturing of most products at SparkFun Packages: 0603 - SMD 0603 package [Product Link] <http://docs.avagotech.com/docs/AV02-0551EN> 0603 SMART - SMD 0603 SMART package ( more efficient and expensive)[Product Link] <http://www.osram-os.com/Graphics/XPic2/00077099_0.pdf> 1206 - SMD1206 package [Product Link] <https://www.sparkfun.com/datasheets/DevTools/LilyPad/Q150OVS4.pdff> SparkFun Products: Pro Mini 328 -5V <https://www.sparkfun.com/products/821> RedBoard <https://www.sparkfun.com/products/12757> IOIO-OTG <https://www.sparkfun.com/products/13613>; PROD_ID: DIO-00819
D3 = DF2S6.2CT:DF2S6.2CT,L3F
D4 D5 = ESD9101P2T5G:ESD9101P2T5G: Low Capacitance ESD Protection Diodes for High Speed Data Lines Source: Datasheet <http://www.onsemi.com/pub/Collateral/ESD9101-D.PDF>; ARROW_PART_NUMBER: ESD9101P2T5G; ARROW_PRICE-STOCK: https://www.arrow.com/en/products/esd9101p2t5g/on-semiconductor; DESCRIPTION: Low Capacitance ESD Protection Diodes for High Speed Data Lines; HEIGHT: 0.4mm; MANUFACTURER_NAME: ON Semiconductor; MANUFACTURER_PART_NUMBER: ESD9101P2T5G; MOUSER_PART_NUMBER: 863-ESD9101P2T5G; MOUSER_PRICE-STOCK: https://www.mouser.co.uk/ProductDetail/ON-Semiconductor/ESD9101P2T5G?qs=5aG0NVq1C4ySlMx2D5w2xw%3D%3D
D6 D7 = PMEG2005ET_215:PMEG2005ET,215: 0.5 A very low VF MEGA Schottky barrier rectifiers in SOT23 package Source: Datasheet <https://assets.nexperia.com/documents/data-sheet/PMEGXX05ET_SER.pdf>; ARROW_PART_NUMBER: PMEG2005ET,215; ARROW_PRICE-STOCK: https://www.arrow.com/en/products/pmeg2005et215/nexperia; DESCRIPTION: 0.5 A very low VF MEGA Schottky barrier rectifiers in SOT23 package; HEIGHT: 1.1mm; MANUFACTURER_NAME: Nexperia; MANUFACTURER_PART_NUMBER: PMEG2005ET,215; MOUSER_PART_NUMBER: 771-PMEG2005ET215; MOUSER_PRICE-STOCK: https://www.mouser.co.uk/ProductDetail/Nexperia/PMEG2005ET215?qs=LOCUfHb8d9tr4RRIpW0zIQ%3D%3D
D8 = PMEG4020ER_115:PMEG4020ER,115: Schottky barrier diode 40V 2A SOD123W Source: Datasheet <https://assets.nexperia.com/documents/data-sheet/PMEG4020ER.pdf>; ARROW_PART_NUMBER: PMEG4020ER,115; ARROW_PRICE-STOCK: https://www.arrow.com/en/products/pmeg4020er115/nexperia; DESCRIPTION: Schottky barrier diode 40V 2A SOD123W; HEIGHT: 1.1mm; MANUFACTURER_NAME: Nexperia; MANUFACTURER_PART_NUMBER: PMEG4020ER,115; MOUSER_PART_NUMBER: 771-PMEG4020ER115; MOUSER_PRICE-STOCK: https://www.mouser.co.uk/ProductDetail/Nexperia/PMEG4020ER115?qs=GcY6OjH1zdmjSoQmiJhL4Q%3D%3D
FL1 = SXBP-101_:SXBP-101+: RF Bandpass Filter, 50ohm, 94-108MHz; AVAILABILITY: Unavailable; DESCRIPTION: RF Bandpass Filter, 50ohm, 94-108MHz; MF: Mini-Circuits; MP: SXBP-101+; PACKAGE: None; PRICE: None
FL2 FL3 = BLM15AG601SN1D:BLM15AG601SN1D: Ferrite: bead; 600Ω; Mounting: SMD; 300mA; -55÷125°C; AVAILABILITY: Unavailable; DESCRIPTION: 600 Ohms @ 100MHz 1 Ferrite Bead 0402 _1005 Metric_ 300mA 520mOhm; MF: Murata; MP: BLM15AG601SN1D; PACKAGE: 1005 Taiyo Yuden; PRICE: None
IC1 = LD1117S50TR:LD1117S50TR: LDO Voltage Regulators 5.0V 0.8A Positive Source: Datasheet <https://datasheet.lcsc.com/szlcsc/STMicroelectronics-LD1117S50TR_C134077.pdf>; ARROW_PART_NUMBER: LD1117S50TR; ARROW_PRICE-STOCK: https://www.arrow.com/en/products/ld1117s50tr/stmicroelectronics; DESCRIPTION: LDO Voltage Regulators 5.0V 0.8A Positive; HEIGHT: 1.9mm; MANUFACTURER_NAME: STMicroelectronics; MANUFACTURER_PART_NUMBER: LD1117S50TR; MOUSER_PART_NUMBER: 511-LD1117S50; MOUSER_PRICE-STOCK: https://www.mouser.co.uk/ProductDetail/STMicroelectronics/LD1117S50TR?qs=eQN2Ig5lfEwsh0kTXN%2FkTg%3D%3D
IC2 = RT8059GJ5:RT8059GJ5: RICHTEK - RT8059GJ5 - IC,DC-DC CONVERTER,BUCK,1.5MHZ,TSOT-23-5 Source: Datasheet <http://www.farnell.com/datasheets/1756324.pdf>; ARROW_PART_NUMBER: RT8059GJ5; DESCRIPTION: RICHTEK - RT8059GJ5 - IC,DC-DC CONVERTER,BUCK,1.5MHZ,TSOT-23-5; HEIGHT: 1mm; MANUFACTURER_NAME: RICHTEK; MANUFACTURER_PART_NUMBER: RT8059GJ5
IC3 = STM32F072CBT6:STM32F072CBT6: STMICROELECTRONICS - STM32F072CBT6 - MCU, 32BIT, CORTEX-M0, 48MHZ, LQFP-48 Source: Datasheet <http://www.farnell.com/datasheets/2006534.pdf>; ARROW_PART_NUMBER: STM32F072CBT6; ARROW_PRICE-STOCK: https://www.arrow.com/en/products/stm32f072cbt6/stmicroelectronics; DESCRIPTION: STMICROELECTRONICS - STM32F072CBT6 - MCU, 32BIT, CORTEX-M0, 48MHZ, LQFP-48; HEIGHT: 1.6mm; MANUFACTURER_NAME: STMicroelectronics; MANUFACTURER_PART_NUMBER: STM32F072CBT6; MOUSER_PART_NUMBER: 511-STM32F072CBT6; MOUSER_PRICE-STOCK: https://www.mouser.co.uk/ProductDetail/STMicroelectronics/STM32F072CBT6?qs=xf9JV0PLFEfBqXx8wKtR8A%3D%3D
J1 = USB3075-30-A:USB3075-30-A: GCT (GLOBAL CONNECTOR TECHNOLOGY) - USB3075-30-A - USB Connector, Micro USB Type B, USB 2.0, Receptacle, 5 Ways, Surface Mount, Right Angle Source: Datasheet <https://componentsearchengine.com/Datasheets/2/USB3075-30-A.pdf>; ARROW_PART_NUMBER: USB3075-30-A; DESCRIPTION: GCT (GLOBAL CONNECTOR TECHNOLOGY) - USB3075-30-A - USB Connector, Micro USB Type B, USB 2.0, Receptacle, 5 Ways, Surface Mount, Right Angle; HEIGHT: 2.7mm; MANUFACTURER_NAME: GCT (GLOBAL CONNECTOR TECHNOLOGY); MANUFACTURER_PART_NUMBER: USB3075-30-A
J2 = adafruit:1X2: 3.5mm Terminal block http://www.ladyada.net/library/pcb/eaglelibrary.html
JP1 = adafruit:PINHD-2X4: PIN HEADER
JP2-JP9 = pinhead:PINHD-1X2: PIN HEADER
L1 L4 = LBMF1608T100K:LBMF1608T100K: Ind Chip Wirewound 10uH 10% 2.52MHz Ferrite 80mA 0603 T/R; AVAILABILITY: Unavailable; DESCRIPTION: 10µH Unshielded Wirewound Inductor 80mA 360mOhm 0603 _1608 Metric_; MF: Taiyo Yuden; MP: LBMF1608T100K; PACKAGE: 1608 Taiyo Yuden; PRICE: None
L2 = HK100515NJ-T:HK100515NJ-T: Ind High Frequency Chip Multi-Layer 15nH 5% 100MHz 8Q-Factor Ceramic 320mA 0402 T/R; AVAILABILITY: Unavailable; DESCRIPTION: 15nH Unshielded Multilayer Inductor 320mA 460mOhm Max 0402 _1005 Metric_; DIGIKEY-PURCHASE-URL: https://snapeda.com/shop?store=DigiKey&id=55773; MF: Taiyo Yuden; MP: HK100515NJ-T; PACKAGE: 1005 Taiyo Yuden; PRICE: None
L3 = CKP20162R2M-T:CKP20162R2M-T: Ind Power Chip Multi-Layer 2.2uH 20% 1MHz Ferrite 1.2A 0806 T/R; AVAILABILITY: Unavailable; DESCRIPTION: 2.2µH Unshielded Multilayer Inductor 1.2A 140mOhm Max 0806 _2016 Metric_; MF: Taiyo Yuden; MP: CKP20162R2M-T; PACKAGE: 2016 Taiyo Yuden; PRICE: None
L5 = LPS3015-683MRB:LPS3015-683MRB: COILCRAFT - LPS3015-683MRB - INDUCTOR, SHLD, 68UH, 20%, 0.25A, SMD Source: Datasheet <https://componentsearchengine.com/Datasheets/2/LPS3015-683MRB.pdf>; ARROW_PART_NUMBER: LPS3015-683MRB; DESCRIPTION: COILCRAFT - LPS3015-683MRB - INDUCTOR, SHLD, 68UH, 20%, 0.25A, SMD; HEIGHT: 1.5mm; MANUFACTURER_NAME: COILCRAFT; MANUFACTURER_PART_NUMBER: LPS3015-683MRB; MOUSER_PART_NUMBER: 994-LPS3015-683MRB; MOUSER_PRICE-STOCK: https://www.mouser.co.uk/ProductDetail/Coilcraft/LPS3015-683MRB?qs=QQJxVsr8EGbGJjGMR6EhxQ%3D%3D
PS1 = LD39050PU33R:LD39050PU33R: STMICROELECTRONICS - LD39050PU33R - LDO, FIXED, 3.3V, 0.5A, DFN-6 Source: Datasheet <https://componentsearchengine.com/Datasheets/2/LD39050PU33R.pdf>; ARROW_PART_NUMBER: LD39050PU33R; ARROW_PRICE-STOCK: https://www.arrow.com/en/products/ld39050pu33r/stmicroelectronics; DESCRIPTION: STMICROELECTRONICS - LD39050PU33R - LDO, FIXED, 3.3V, 0.5A, DFN-6; HEIGHT: 1mm; MANUFACTURER_NAME: STMicroelectronics; MANUFACTURER_PART_NUMBER: LD39050PU33R; MOUSER_PART_NUMBER: 511-LD39050PU33R; MOUSER_PRICE-STOCK: https://www.mouser.co.uk/ProductDetail/STMicroelectronics/LD39050PU33R?qs=5HwTSiuA5HCrgw9sKi%2FGcQ%3D%3D
R1-R9 R11 R12 R14-R25 R28-R30 R33 = rcl:R-US_: RESISTOR, American symbol; SPICEPREFIX: R
R31 R37-R39 SB1 SB2 SB4 SB5 = adafruit:R-US_: RESISTOR, American symbol
RESET = st-mod v1.4:TS42: TS42 Dongnan Electronics Tact switch VDC 12V - 50mA
TP1-TP4 = 52101-101-REV-A:TESTPOINT_TPS: TEST POINT PAD; BOM: EXCLUDE
U1 = ADL5511ACPZ-R7:ADL5511ACPZ-R7: DC to 6 GHz Envelope and TruPwr RMS Detector; AVAILABILITY: Unavailable; DESCRIPTION: RF Detector IC CDMA, CDMA2000, LTE, WiMAX 0Hz ~ 6GHz -28dBm ~ 17dBm 16-WFQFN Exposed Pad, CSP; MF: Analog Devices; MP: ADL5511ACPZ-R7; PACKAGE: LFCSP -16 Analog Devices; PRICE: None
U2 = LTC6957HMS-4_PBF:LTC6957HMS-4#PBF: Low Phase Noise, Dual Output Buffer/Driver/Logic Converter; AVAILABILITY: Unavailable; DESCRIPTION: Low Phase Noise, Dual Output Buffer/Driver/Logic Converter; MF: Analog Devices; MP: LTC6957HMS-4#PBF; PACKAGE: MSOP-12 Analog Devices; PRICE: None
U3 U7 = DS1023S-25_T:DS1023S-25+T; AVAILABILITY: Unavailable; DESCRIPTION: Active Programmable Delay Line 1-IN 0.25ns ABS 63.75ns MAX 16-Pin SOIC W T/R; MF: Maxim Integrated; MP: DS1023S-25+T; PACKAGE: SOIC-16 Maxim; PRICE: None
U4 U5 U8 = 74LVC1G04GW:74LVC1G04GW: Single inverter; AVAILABILITY: Unavailable; DESCRIPTION: pin, supply, number, sot, ic, cmos, temperature, min, current, Semiconductors and Actives, gate, inputs, max, tssop, ...; MF: Nexperia USA; MP: 74LVC1G04GW; PACKAGE: None; PRICE: None
U6 = DW1000-I:DW1000-I: The DW1000 is a fully integrated single chip Ultra Wideband (UWB) low-power low-cost transceiver IC compliant to IEEE802.15.4-2011. It can be used in 2-way ranging or TDOA location systems to locate assets to a precision of 10 cm. It also supports data transfer at rates up to 6.8 Mbps; AVAILABILITY: Unavailable; DESCRIPTION: IC RF TxRx Only 802.15.4 IR-UWB 3.5GHz ~ 6.5GHz 48-VFQFN Exposed Pad; MF: Decawave Limited; MP: DW1000-I; PACKAGE: QFN-48 Decawave; PRICE: None
U9 = NRF52832-QFAA-R:NRF52832-QFAA-R: Bluetooth SMART SOC IoT 2000Mbps 48-Pin QFN EP T/R; AVAILABILITY: Unavailable; DESCRIPTION: IC RF TxRx + MCU Bluetooth, General ISM > 1GHz ANT, Bluetooth v5.0 2.4GHz 48-VFQFN Exposed Pad; DIGIKEY-PURCHASE-URL: https://snapeda.com/shop?store=DigiKey&id=279951; MF: Nordic; MP: NRF52832-QFAA-R; PACKAGE: VFQFN-48 Nordic; PRICE: None
U10 = CDCLVC1104PWR:CDCLVC1104PWR: Low Jitter, 1: 4 LVCMOS Fan-out Clock Buffer 8-TSSOP -40 to 85; AVAILABILITY: Unavailable; DESCRIPTION: Low Jitter, 1: 4 LVCMOS Fan-out Clock Buffer 8-TSSOP -40 to 85; MF: Texas Instruments; MP: CDCLVC1104PWR; PACKAGE: TSSOP-8 Texas Instruments; PRICE: None
U11 = LM3671MF-1.8:LM3671MF-1.8: IC BUCK SYNC 1.8V 0.6A; ARROW_ELECTRONICS-PURCHASE-URL: https://snapeda.com/shop?store=Arrow+Electronics&id=30333; AVAILABILITY: Unavailable; DESCRIPTION: Buck Switching Regulator IC Positive Fixed 1.8V 1 Output 600mA SC-74A, SOT-753; DIGIKEY-PURCHASE-URL: https://snapeda.com/shop?store=DigiKey&id=30333; MF: Texas Instruments; MP: LM3671MF-1.8/NOPB; PACKAGE: SOT-23 Texas Instruments; PRICE: None
U12 = SN74AC04D:SN74AC04D: Hex Inverters; AVAILABILITY: Unavailable; DESCRIPTION: Inverter IC 6 Channel 14-SOIC; MF: Texas Instruments; MP: SN74AC04D; PACKAGE: SOIC-14 Texas Instruments; PRICE: None
U$6 = PIC12F675-I_P:PIC12F675-I/P; AVAILABILITY: Unavailable; DESCRIPTION: PIC PIC® 12F Microcontroller IC 8-Bit 20MHz 1.75KB _1K x 14_ FLASH 8-PDIP; MF: Microchip; MP: PIC12F675-I/P; PACKAGE: DIP-8 Microchip; PRICE: None
X1-X9 X12 X17 X18 = adafruit:SMACONNECTOR: SMA Connector 90° DIP SMA Connector, 50 Ohm (4UConnector: 07259)
Y1 = ABM11W-32.0000MHZ-8-B1U-T3:ABM11W-32.0000MHZ-8-B1U-T3: Crystal 32.0000mhz 8pf Smd; AVAILABILITY: Unavailable; DESCRIPTION: 32MHz ±10ppm Crystal 8pF 80 Ohms 4-SMD, No Lead; DIGIKEY-PURCHASE-URL: https://snapeda.com/shop?store=DigiKey&id=2583411; MF: Abracon LLC; MP: ABM11W-32.0000MHZ-8-B1U-T3; PACKAGE: SMD-4 Abracon LLC; PRICE: None
Y2 = ABS07-32.768KHZ-1-T:ABS07-32.768KHZ-1-T: ABS07 Series 32.768 kHz ±20 ppm 12.5 pF -40 to +85 C SMT Low Profile Crystal; AVAILABILITY: Unavailable; DESCRIPTION: 32.768kHz ±10ppm Crystal 12.5pF 70 kOhms 2-SMD, No Lead; DIGIKEY-PURCHASE-URL: https://snapeda.com/shop?store=DigiKey&id=384551; MF: Abracon; MP: ABS07-32.768KHZ-1-T; PACKAGE: SMD-2 Abracon; PRICE: None

## Net classes
1 diff_pairs: width 0.216 mm